# EAGLE design FemaleFlexConn (EAGLE 7.4.0)
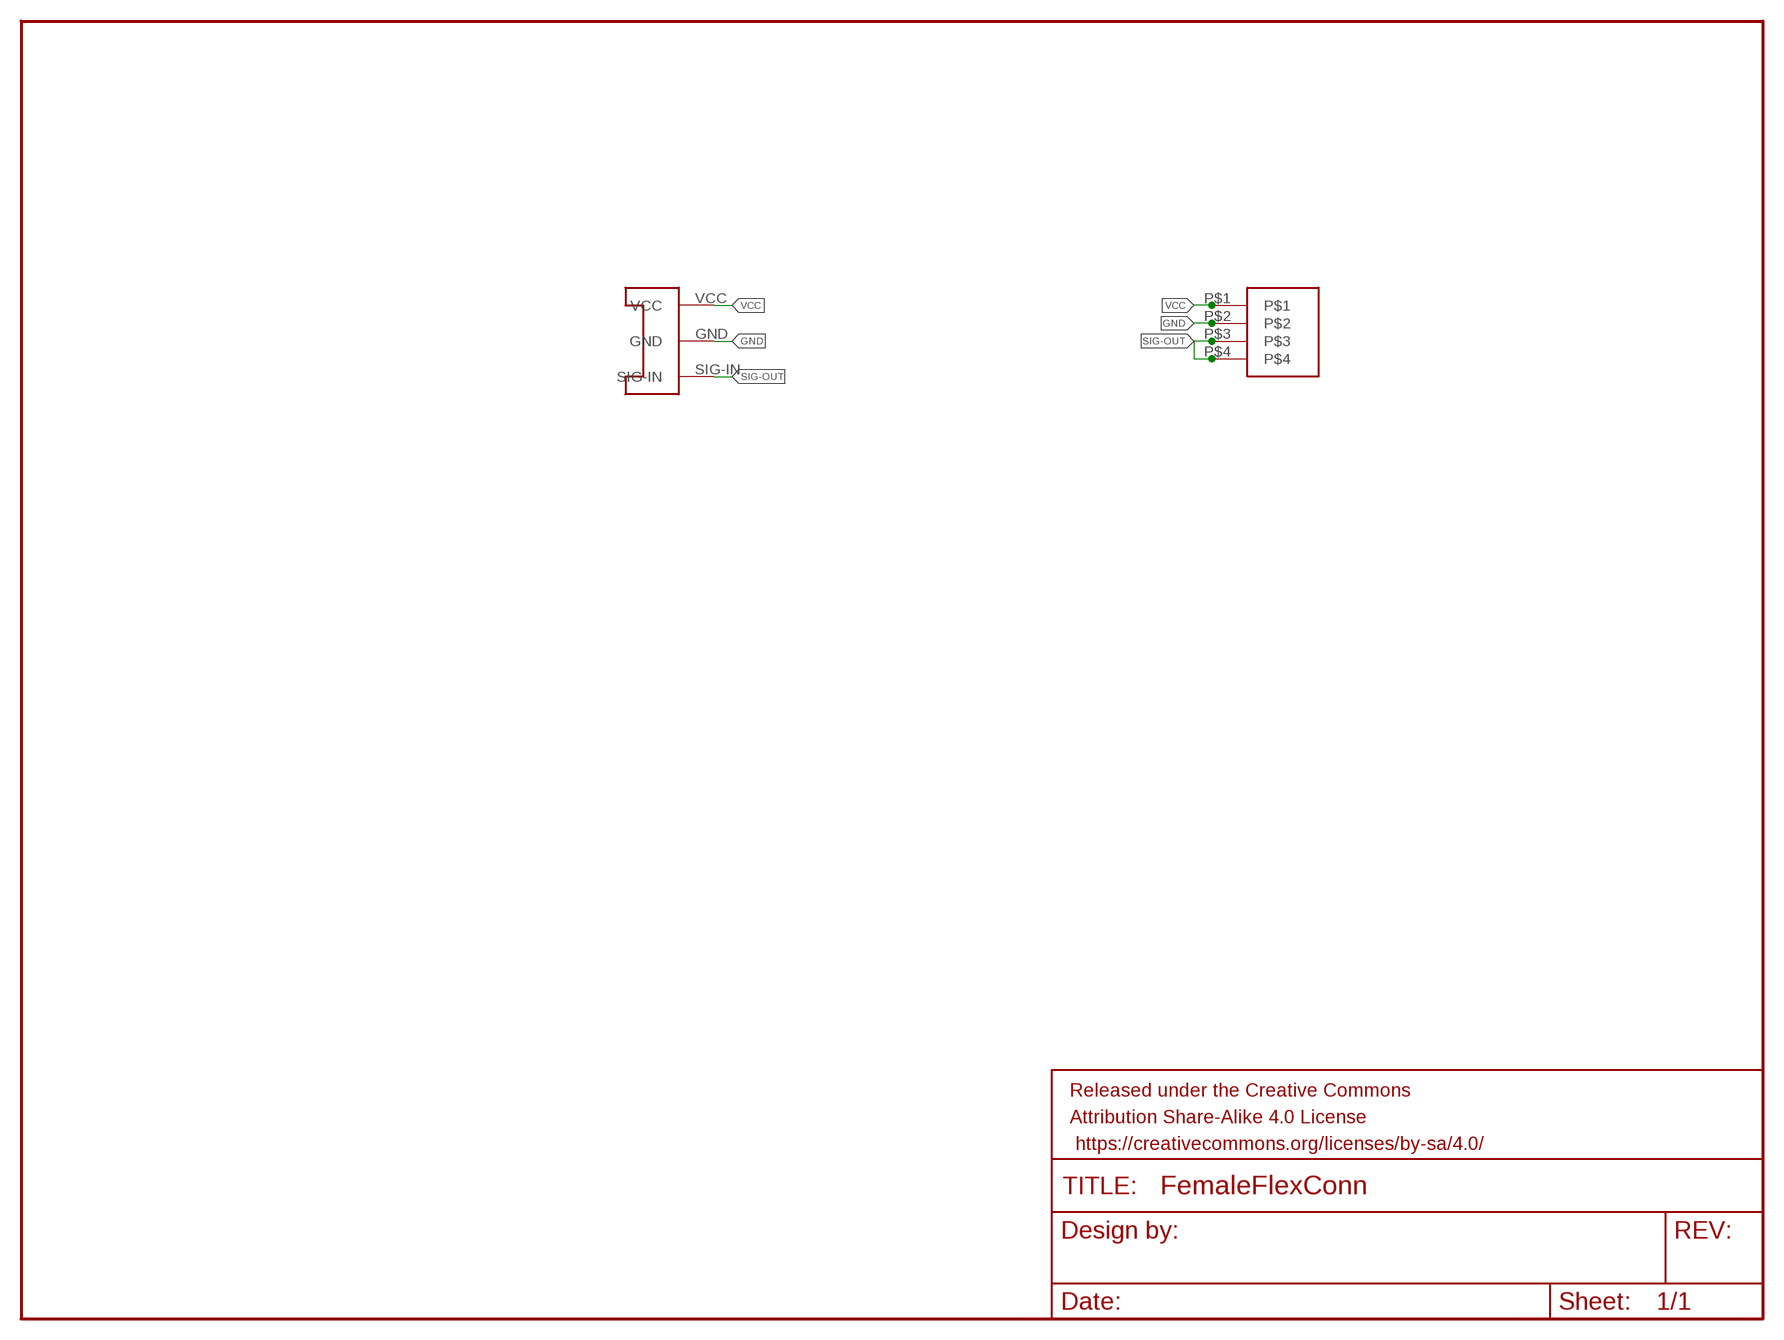
[diagram p0: schematic, sheet 1]

## Parts
FRAME1  FRAME-LETTERNO_PACKAGE  [DUMMY]
U$1  CONN-RCPT-BLADE-4POS-4MM  [RECEPT-BLAD-4MM-SMD]
U$2  CONN-SOCKET-3POS-3MM  [SOCKET-3POS-3MM-SMD]

## Nets
GND: U$1.P$2 U$2.GND
SIG-OUT: U$1.P$3 U$1.P$4 U$2.SIG-IN
VCC: U$1.P$1 U$2.VCC

## Library data of the parts
FRAME1 = SparkFun-Aesthetics:FRAME-LETTER: Schematic Frame Standard 8.5x11 US Letter frame; DESIGNER: Nobody; VERSION: v01
U$1 = EmbeddedPlayground:CONN-RCPT-BLADE-4POS-4MM
U$2 = EmbeddedPlayground:CONN-SOCKET-3POS-3MM: Surface mount board to board connector. Female socket, 3 position.

## Board
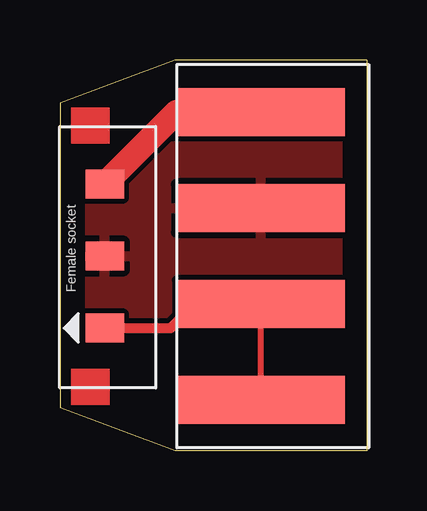
[diagram p1: board, top side]
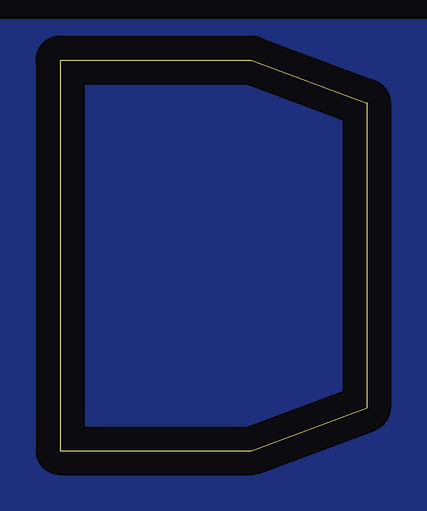
[diagram p2: board, bottom side, seen from below]

Size 12.79 x 16.3 mm. Coordinates in mm from the lower left corner, seen from the top.
Outline: 0,14.51 0,14.5
Outline: 0,14.5 0,1.8 4.8,0 12.79,0 12.79,16.3 4.8,16.3 0,14.5
Copper layers (1*16): Top 0.035mm / dielectric 1.5mm / Bottom 0.035mm
Design rules "default": minimum track width 10mil, minimum drill 24mil, track to track 8mil, track to pad 8mil, pad to pad 8mil, via to via 8mil, smd to smd 8mil, copper to edge 40mil, drill to drill 8mil, minimum pad ring 10mil, minimum via ring 8mil, stop-mask expansion 4mil, vias tented up to drill 0mil, thermal gap 10mil

### Footprints (pad centres in the part's own frame; a part is rotated, then mirrored left to right if it is on the bottom)
RECEPT-BLAD-4MM-SMD = smd 2 x 7: P$1 -6,0; P$2 -2,0; P$3 2,0; P$4 6,0
SOCKET-3POS-3MM-SMD = smd 1.2 x 1.6: GND 0,0; SIG-IN -3,0; VCC 3,0

### Placement (x,y rotation side)
FRAME1  0,0 0 top
U$1  8.38,8.12 270 top
U$2  1.87,8.12 90 top

### Tracks (layer width: path | path; a pad name or v marks a point on that pad's centre or on a via)
GND
  pour Bottom: -2.54,17.78 26.67,17.78 26.67,-2.54 -2.54,-2.54
  pour Top: -2.6,17.8 26.7,17.8 26.7,-2.7 -2.6,-2.7
SIG-OUT
  Top 0.254: U$1.P$4 U$1.P$3
  Top 0.406: U$2.SIG-IN 4.62,5.12 5.6,6.1 8.87,6.1 U$1.P$3
VCC
  Top 1.016: U$1.P$1 4.87,14.12 U$2.VCC